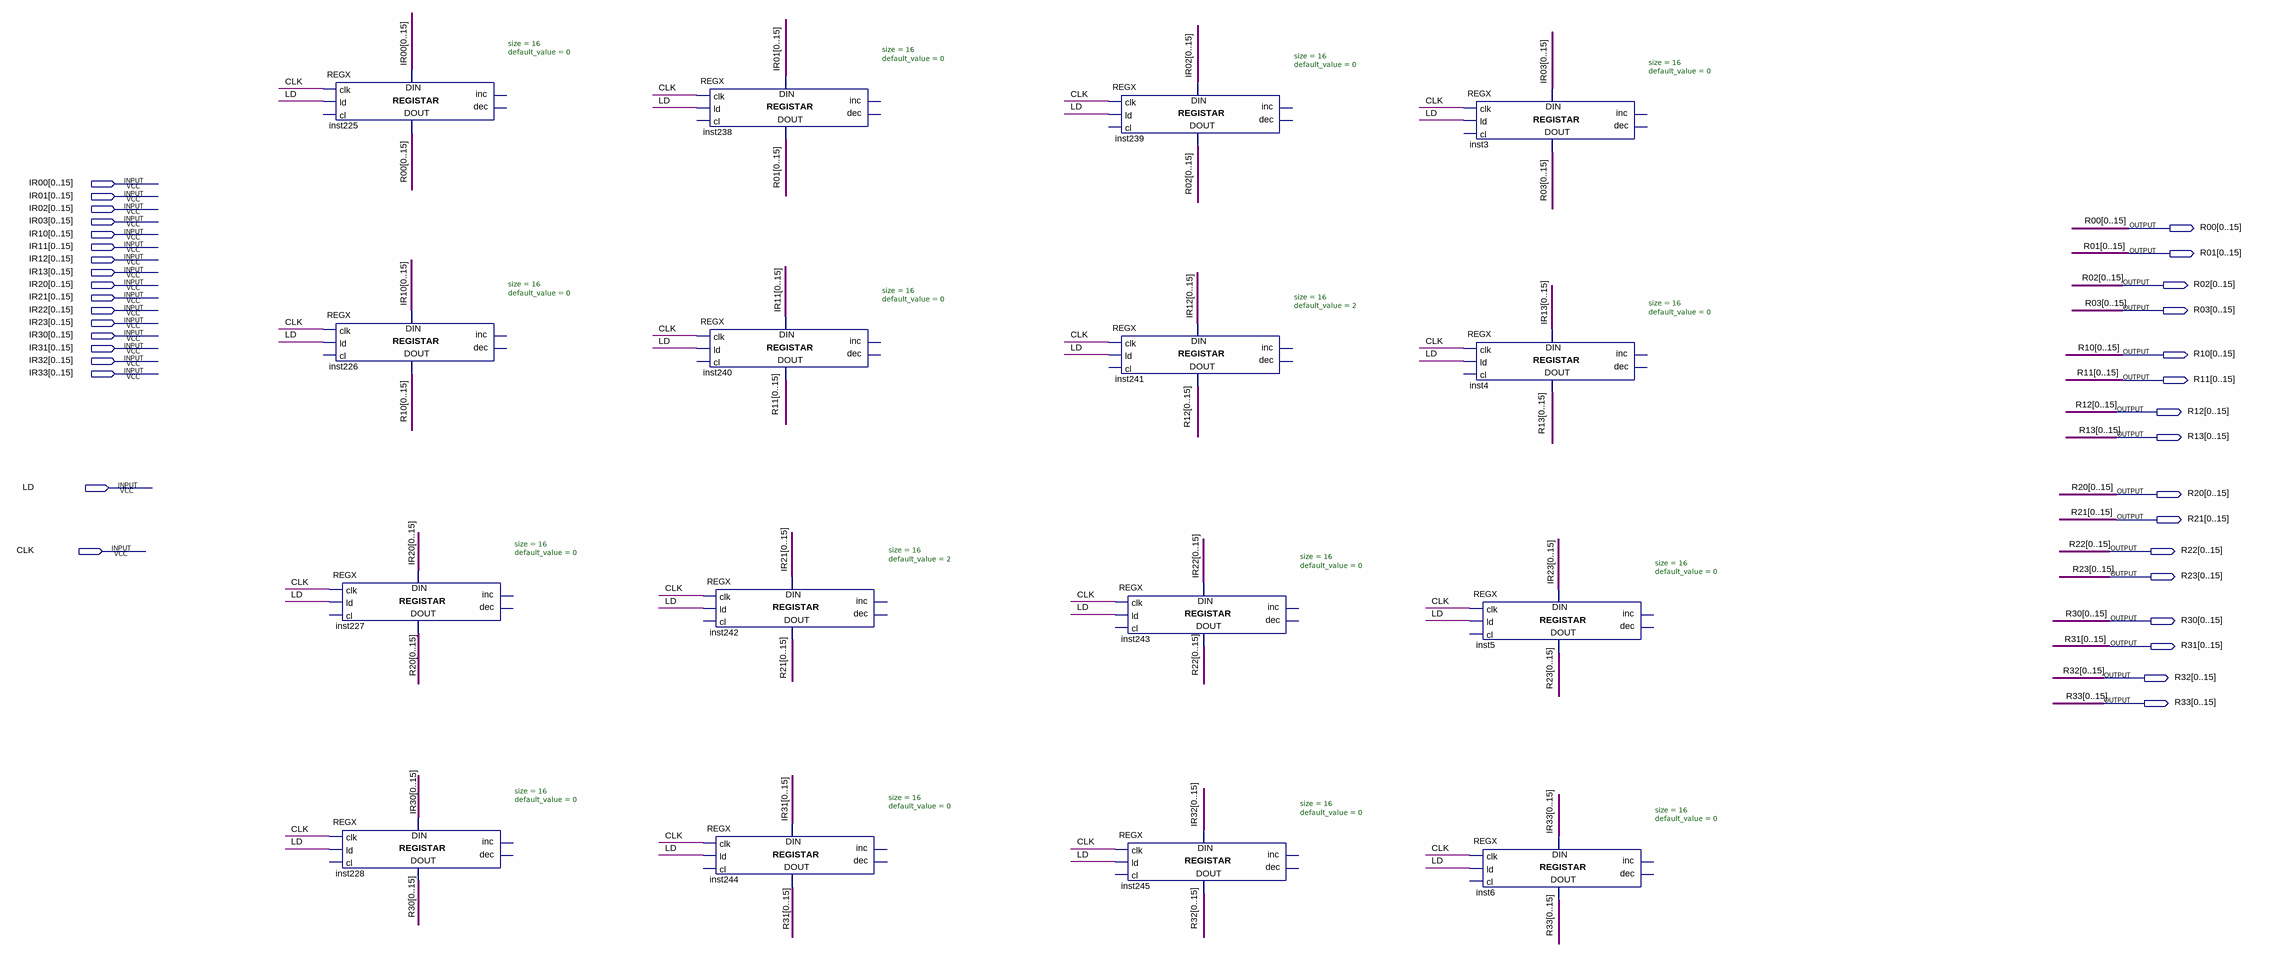
[diagram p0: schematic sheet]
// Quartus schematic BOX.bdf as structural Verilog: 16 symbols, 34 pins
module BOX (
  input  [0:15] IR00,
  input  [0:15] IR01,
  input  [0:15] IR02,
  input  [0:15] IR03,
  input  [0:15] IR10,
  input  [0:15] IR11,
  input  [0:15] IR12,
  input  [0:15] IR13,
  input  [0:15] IR20,
  input  [0:15] IR21,
  input  [0:15] IR22,
  input  [0:15] IR23,
  input  [0:15] IR30,
  input  [0:15] IR31,
  input  [0:15] IR32,
  input  [0:15] IR33,
  input  LD,
  input  CLK,
  output [0:15] R00,
  output [0:15] R01,
  output [0:15] R02,
  output [0:15] R03,
  output [0:15] R10,
  output [0:15] R11,
  output [0:15] R12,
  output [0:15] R13,
  output [0:15] R20,
  output [0:15] R21,
  output [0:15] R22,
  output [0:15] R23,
  output [0:15] R30,
  output [0:15] R31,
  output [0:15] R32,
  output [0:15] R33
);

  REGX #(.size(16), .default_value(0)) inst225 (
    .clk(CLK), .ld(LD), .data_in(IR00), .data_out(R00));  // open: cl, inc, dec
  REGX #(.size(16), .default_value(0)) inst226 (
    .clk(CLK), .ld(LD), .data_in(IR10), .data_out(R10));  // open: cl, inc, dec
  REGX #(.size(16), .default_value(0)) inst227 (
    .clk(CLK), .ld(LD), .data_in(IR20), .data_out(R20));  // open: cl, inc, dec
  REGX #(.size(16), .default_value(0)) inst228 (
    .clk(CLK), .ld(LD), .data_in(IR30), .data_out(R30));  // open: cl, inc, dec
  REGX #(.size(16), .default_value(0)) inst238 (
    .clk(CLK), .ld(LD), .data_in(IR01), .data_out(R01));  // open: cl, inc, dec
  REGX #(.size(16), .default_value(0)) inst240 (
    .clk(CLK), .ld(LD), .data_in(IR11), .data_out(R11));  // open: cl, inc, dec
  REGX #(.size(16), .default_value(2)) inst242 (
    .clk(CLK), .ld(LD), .data_in(IR21), .data_out(R21));  // open: cl, inc, dec
  REGX #(.size(16), .default_value(0)) inst244 (
    .clk(CLK), .ld(LD), .data_in(IR31), .data_out(R31));  // open: cl, inc, dec
  REGX #(.size(16), .default_value(0)) inst239 (
    .clk(CLK), .ld(LD), .data_in(IR02), .data_out(R02));  // open: cl, inc, dec
  REGX #(.size(16), .default_value(2)) inst241 (
    .clk(CLK), .ld(LD), .data_in(IR12), .data_out(R12));  // open: cl, inc, dec
  REGX #(.size(16), .default_value(0)) inst243 (
    .clk(CLK), .ld(LD), .data_in(IR22), .data_out(R22));  // open: cl, inc, dec
  REGX #(.size(16), .default_value(0)) inst245 (
    .clk(CLK), .ld(LD), .data_in(IR32), .data_out(R32));  // open: cl, inc, dec
  REGX #(.size(16), .default_value(0)) inst3 (
    .clk(CLK), .ld(LD), .data_in(IR03), .data_out(R03));  // open: cl, inc, dec
  REGX #(.size(16), .default_value(0)) inst4 (
    .clk(CLK), .ld(LD), .data_in(IR13), .data_out(R13));  // open: cl, inc, dec
  REGX #(.size(16), .default_value(0)) inst5 (
    .clk(CLK), .ld(LD), .data_in(IR23), .data_out(R23));  // open: cl, inc, dec
  REGX #(.size(16), .default_value(0)) inst6 (
    .clk(CLK), .ld(LD), .data_in(IR33), .data_out(R33));  // open: cl, inc, dec
endmodule
